# EasyEDA Pro project pcb_vc.eprj

# Schematic Sheet3
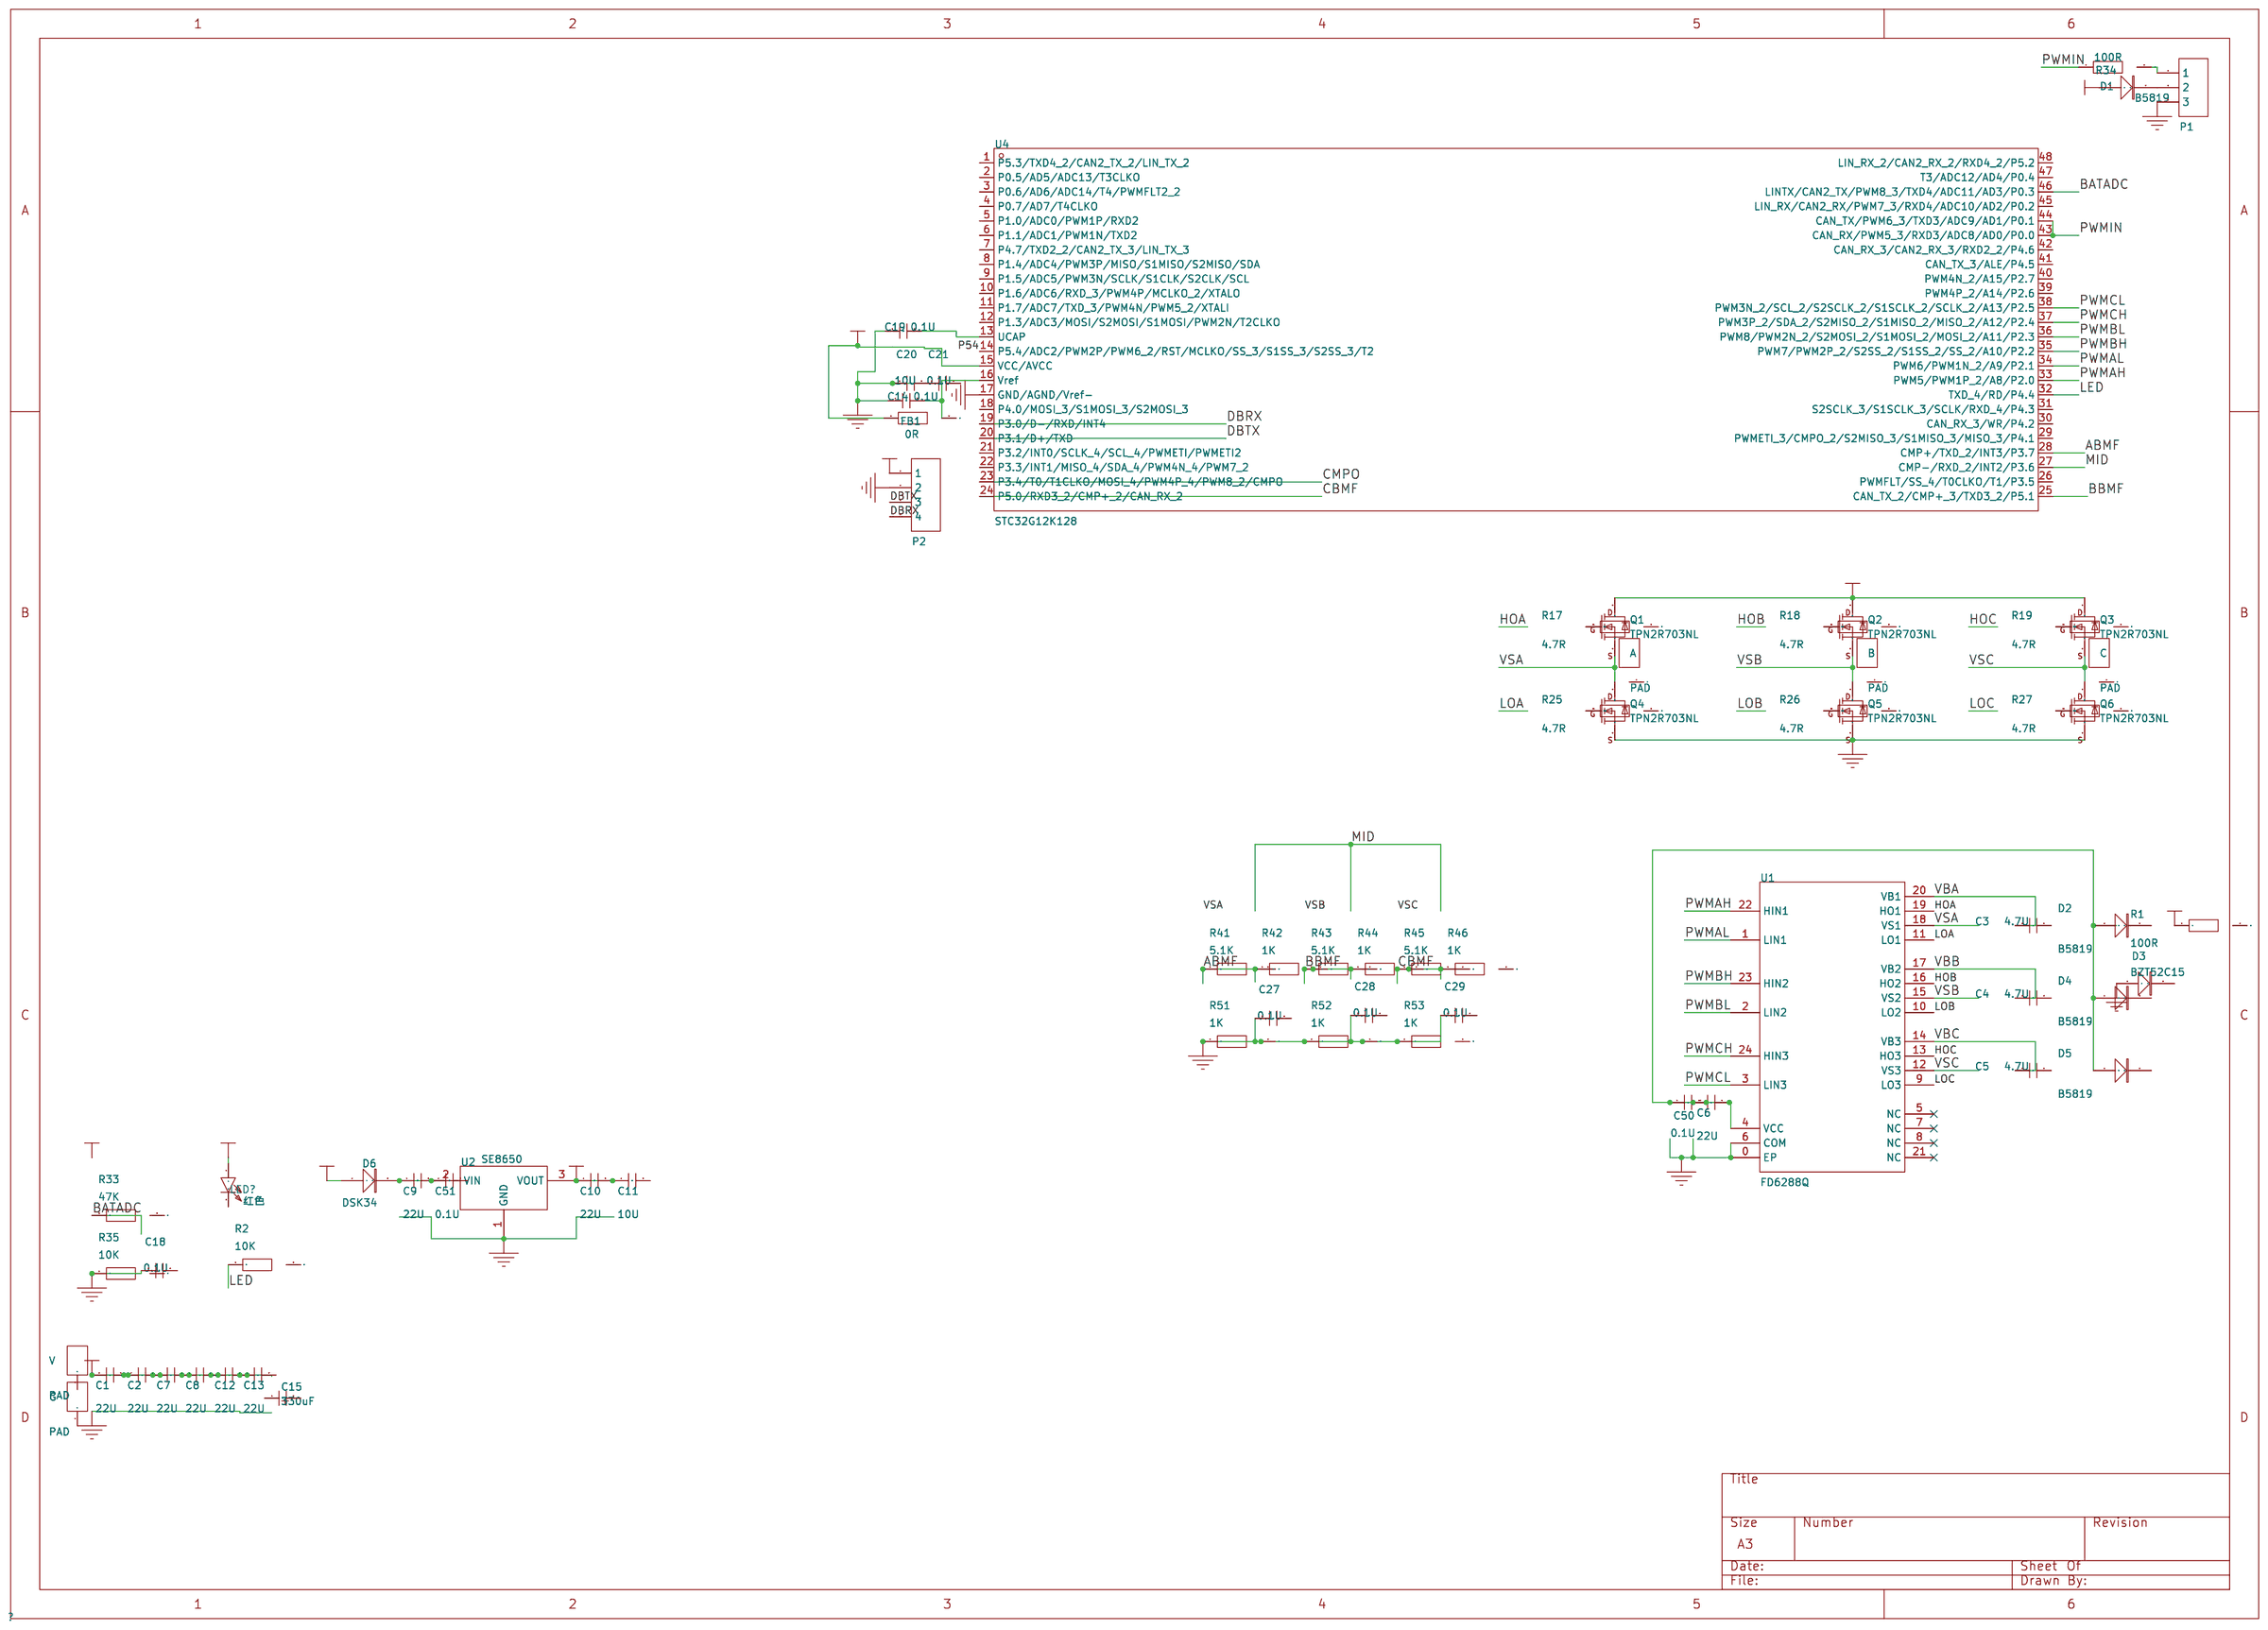
[diagram p0: schematic sheet]

## Parts
A  PAD  [PAD]
B  PAD  [PAD]
C  PAD  [PAD]
C1  22U  [C 0805_L]
C2  22U  [C 0805_L]
C3  4.7U  [C 0805_L]
C4  4.7U  [C 0805_L]
C5  4.7U  [C 0805_L]
C6  22U  [C 0805_L]
C7  22U  [C 0805_L]
C8  22U  [C 0805_L]
C9  22U  [C 0805_L]
C10  22U  [C 0805_L]
C11  10U  [C 0603_L]
C12  22U  [C 0805_L]
C13  22U  [C 0805_L]
C14  0.1U  [C 0402_L]
C15  330uF  [CAP(固态_5mm)]
C18  0.1U  [C 0603_L]
C19  0.1U  [C 0402_L]
C20  10U  [C 0603_L]
C21  0.1U  [C 0402_L]
C27  0.1U  [C 0603_L]
C28  0.1U  [C 0603_L]
C29  0.1U  [C 0603_L]
C50  0.1U  [C 0603_L]
C51  0.1U  [C 0402_L]
D1  B5819  [SOD-123]
D2  B5819  [SOD-123]
D3  BZT52C15  [SOD-123]
D4  B5819  [SOD-123]
D5  B5819  [SOD-123]
D6  DSK34  [SOD-123]
FB1  0R  [R 0603_L]
G  PAD  [PAD]
LED?#1  红色  [LED 0603B]
P1  HDR-1X3  [HDR2.54-LI-3P]
P2  HDR-1X4  [HDR2.54-LI-4P]
Q1  TPN2R703NL  [TPN2R703NL]
Q2  TPN2R703NL  [TPN2R703NL]
Q3  TPN2R703NL  [TPN2R703NL]
Q4  TPN2R703NL  [TPN2R703NL]
Q5  TPN2R703NL  [TPN2R703NL]
Q6  TPN2R703NL  [TPN2R703NL]
R1  100R  [R 0603_L]
R2  10K  [R 0603_L]
R17  4.7R  [R 0603_L]
R18  4.7R  [R 0603_L]
R19  4.7R  [R 0603_L]
R25  4.7R  [R 0603_L]
R26  4.7R  [R 0603_L]
R27  4.7R  [R 0603_L]
R33  47K  [R 0603_L]
R34  100R  [R 0603_L]
R35  10K  [R 0603_L]
R41  5.1K  [R 0603_L]
R42  1K  [R 0603_L]
R43  5.1K  [R 0603_L]
R44  1K  [R 0603_L]
R45  5.1K  [R 0603_L]
R46  1K  [R 0603_L]
R51  1K  [R 0603_L]
R52  1K  [R 0603_L]
R53  1K  [R 0603_L]
U1  FD6288Q  [FD6288Q]
U2  SE8650  [SE8650]
U4  STC32G12K128  [STC32G12K128]
V  PAD  [PAD]

## Library data of the parts
A B C G V = PAD: Library Name: 视觉原理图库
C1-C10 C12 C13 = C: 贴片电容; BOM名称: 无极性贴片电容; 淘宝ID: 封装库来自淘宝 ID：黄晶宝石; 联系售后: https://shop463601444.taobao.com; Origin Footprint 2: R 0603_L; Origin Footprint 3: C 0402_L; Origin Footprint 4: C 0603_L; Origin Footprint 5: C 1206_L; Origin Footprint 6: C 1210_L; Origin Footprint 7: C 1808_L; Origin Footprint 8: C 1812_L; Origin Footprint 9: C 1825_L; Origin Footprint 10: C 2225_L; Origin Footprint 11: C 0201_M; Origin Footprint 12: C 0402_M; Origin Footprint 13: C 0603_M; Origin Footprint 14: C 0805_M; Origin Footprint 15: C 1206_M; Origin Footprint 16: C 1210_M; Origin Footprint 17: C 1808_M; Origin Footprint 18: C 1812_M; Origin Footprint 19: C 1825_M; Origin Footprint 20: C 2225_M; Library Name: 0.1 - 电阻-电容-电感
C11 C18 C20 C27-C29 C50 = C: 贴片电容; BOM名称: 无极性贴片电容; 淘宝ID: 封装库来自淘宝 ID：黄晶宝石; 联系售后: https://shop463601444.taobao.com; Origin Footprint 2: R 0603_L; Origin Footprint 3: C 0402_L; Origin Footprint 4: C 0805_L; Origin Footprint 5: C 1206_L; Origin Footprint 6: C 1210_L; Origin Footprint 7: C 1808_L; Origin Footprint 8: C 1812_L; Origin Footprint 9: C 1825_L; Origin Footprint 10: C 2225_L; Origin Footprint 11: C 0201_M; Origin Footprint 12: C 0402_M; Origin Footprint 13: C 0603_M; Origin Footprint 14: C 0805_M; Origin Footprint 15: C 1206_M; Origin Footprint 16: C 1210_M; Origin Footprint 17: C 1808_M; Origin Footprint 18: C 1812_M; Origin Footprint 19: C 1825_M; Origin Footprint 20: C 2225_M; Library Name: 0.1 - 电阻-电容-电感
C14 C19 C21 C51 = C: 贴片电容; BOM名称: 无极性贴片电容; 淘宝ID: 封装库来自淘宝 ID：黄晶宝石; 联系售后: https://shop463601444.taobao.com; Origin Footprint 2: R 0603_L; Origin Footprint 3: C 0603_L; Origin Footprint 4: C 0805_L; Origin Footprint 5: C 1206_L; Origin Footprint 6: C 1210_L; Origin Footprint 7: C 1808_L; Origin Footprint 8: C 1812_L; Origin Footprint 9: C 1825_L; Origin Footprint 10: C 2225_L; Origin Footprint 11: C 0201_M; Origin Footprint 12: C 0402_M; Origin Footprint 13: C 0603_M; Origin Footprint 14: C 0805_M; Origin Footprint 15: C 1206_M; Origin Footprint 16: C 1210_M; Origin Footprint 17: C 1808_M; Origin Footprint 18: C 1812_M; Origin Footprint 19: C 1825_M; Origin Footprint 20: C 2225_M; Library Name: 0.1 - 电阻-电容-电感
C15 = Cap_固态电容: Library Name: NXP
D1-D6 = 1N4007: 整流二极管; BOM名称: 整流二极管; 联系售后: https://shop463601444.taobao.com; 淘宝ID: 封装库来自淘宝 ID：黄晶宝石; Origin Footprint 2: DO-41; Origin Footprint 3: SMA; Origin Footprint 4: DO-41V; Library Name: 0.2 -  二极管-整流桥
FB1 R1 R2 R17-R19 R25-R27 R33-R35 R41-R46 R51-R53 = R: 贴片电阻; BOM名称: 贴片电阻; 联系售后: https://shop463601444.taobao.com; 版权归属: 来自淘宝 ID：黄晶宝石; Origin Footprint 2: R 0201_L; Origin Footprint 3: R 0402_L; Origin Footprint 4: R 0805_L; Origin Footprint 5: R 1206_L; Origin Footprint 6: R 1210_L; Origin Footprint 7: R 1812_L; Origin Footprint 8: R 2010_L; Origin Footprint 9: R 2512_L; Origin Footprint 10: R 0201_M; Origin Footprint 11: R 0402_M; Origin Footprint 12: R 0603_M; Origin Footprint 13: R 0805_M; Origin Footprint 14: R 1206_M; Origin Footprint 15: R 1210_M; Origin Footprint 16: R 1812_M; Origin Footprint 17: R 2010_M; Origin Footprint 18: R 2512_M; Library Name: 0.1 - 电阻-电容-电感
LED?#1 = LED-SMD: 贴片LED; BOM名称: 贴片LED; 学习资源: https://shop463601444.taobao.com; 版权归属: 封装库来自淘宝 ID：黄晶宝石; Origin Footprint 2: LED 0603W; Origin Footprint 3: LED 0603R; Origin Footprint 4: LED 0603G; Origin Footprint 5: LED 0603Y; Origin Footprint 6: LED 0805G; Origin Footprint 7: LED 0805R; Origin Footprint 8: LED 0805B; Origin Footprint 9: LED 0805Y; Origin Footprint 10: LED 3528-2Pin; Origin Footprint 11: LED 1206G; Origin Footprint 12: LED 5730-V; Origin Footprint 13: LED 1206Y; Origin Footprint 14: LED 0805W; Origin Footprint 15: LED 1206B; Origin Footprint 16: LED 1206W; Origin Footprint 17: LED 1206R; Library Name: 0.3 - LED发光二极管
P1 = Header 3: 3P接插件; BOM名称: 3P接插件; 版权归属: 封装库来自淘宝 ID：黄晶宝石; 学习资源: https://shop463601444.taobao.com; Origin Footprint 2: XH2.54-WI-3P; Origin Footprint 3: XH2.54-LI-3P; Origin Footprint 4: HDR2.54-M-LI-3P; Origin Footprint 5: HDR2.54-WI-3P; Origin Footprint 6: HDR2.54-WS-3P; Origin Footprint 7: HDR2.54-Y-LI-3P; Origin Footprint 8: HDR2.54-M-WS-3P; Origin Footprint 9: KF2510-LI-3P; Origin Footprint 10: XH2.54-WS-3P; Origin Footprint 11: XH2.54-LS-3P; Origin Footprint 12: KF2EDGK-2.54-LI-3P; Origin Footprint 13: KF2EDGK-2.54-WI-3P; Library Name: 5.3 - 接插件-脚距2.54 (100mil)
P2 = Header 4: 4P接插件; BOM名称: 4P接插件; 版权归属: 封装库来自淘宝 ID：黄晶宝石; 学习资源: https://shop463601444.taobao.com; Origin Footprint 2: XH2.54-WI-4P; Origin Footprint 3: XH2.54-LI-4P; Origin Footprint 4: HDR2.54-M-LI-4P; Origin Footprint 5: HDR2.54-WI-4P; Origin Footprint 6: HDR2.54-WS-4P; Origin Footprint 7: HDR2.54-Y-LI-4P; Origin Footprint 8: HDR2.54-M-WS-4P; Origin Footprint 9: KF2510-LI-4P; Origin Footprint 10: XH2.54-WS-4P; Origin Footprint 11: XH2.54-LS-4P; Origin Footprint 12: KF2EDGK-2.54-LI-4P; Origin Footprint 13: KF2EDGK-2.54-WI-4P; Library Name: 5.3 - 接插件-脚距2.54 (100mil)
Q1-Q6 = TPN2R703NL: Library Name: 视觉原理图库
U1 = FD6288Q: Library Name: 视觉原理图库
U2 = SE8650: Library Name: 视觉原理图库
U4 = STC32G12K128: Library Name: 视觉原理图库

## Nets
GND: C1.2 C2.2 C6.2 C7.2 C8.2 C9.2 C10.2 C11.2 C12.2 C13.2 C14.1 C15.2 C18.1 C19.1 C20.1 C21.1 C27.1 C28.1 C29.1 C50.2 C51.2 D3.1(A) G.1 P1.3 P2.2 Q4.3(S) Q5.3(S) Q6.3(S) R35.1 R51.1 R52.1 R53.1 U1.0(EP) U1.6(COM) U2.1(GND) U4.17(GND/AGND/Vref-)
VBAT: C1.1 C2.1 C7.1 C8.1 C12.1 C13.1 C15.1 D6.1(A) LED?#1.1(A) Q1.1(D) Q2.1(D) Q3.1(D) R1.1 R33.2 V.1
VCC5V: C10.1 C11.1 C20.2 C21.2 D1.1(A) FB1.1 P2.1 U2.3(VOUT) U4.15(VCC/AVCC)
ABMF: C27.2 R41.1 R42.1 R51.2 U4.28(CMP+/TXD_2/INT3/P3.7)
BATADC: C18.2 R33.1 R35.2 U4.46(LINTX/CAN2_TX/PWM8_3/TXD4/ADC11/AD3/P0.3)
BBMF: C28.2 R43.1 R44.1 R52.2 U4.25(CAN_TX_2/CMP+_3/TXD3_2/P5.1)
CBMF: C29.2 R45.1 R46.1 R53.2 U4.24(P5.0/RXD3_2/CMP+_2/CAN_RX_2)
CMPO: U4.23(P3.4/T0/T1CLKO/MOSI_4/PWM4P_4/PWM8_2/CMPO)
DBRX: P2.4 U4.19(P3.0/D-/RXD/INT4)
DBTX: P2.3 U4.20(P3.1/D+/TXD)
HOA: R17.2 U1.19(HO1)
HOB: R18.2 U1.16(HO2)
HOC: R19.2 U1.13(HO3)
LED: R2.1 U4.32(TXD_4/RD/P4.4)
LOA: R25.2 U1.11(LO1)
LOB: R26.2 U1.10(LO2)
LOC: R27.2 U1.9(LO3)
MID: R42.2 R44.2 R46.2 U4.27(CMP-/RXD_2/INT2/P3.6)
P54: U4.14(P5.4/ADC2/PWM2P/PWM6_2/RST/MCLKO/SS_3/S1SS_3/S2SS_3/T2)
PWMAH: U1.22(HIN1) U4.33(PWM5/PWM1P_2/A8/P2.0)
PWMAL: U1.1(LIN1) U4.34(PWM6/PWM1N_2/A9/P2.1)
PWMBH: U1.23(HIN2) U4.35(PWM7/PWM2P_2/S2SS_2/S1SS_2/SS_2/A10/P2.2)
PWMBL: U1.2(LIN2) U4.36(PWM8/PWM2N_2/S2MOSI_2/S1MOSI_2/MOSI_2/A11/P2.3)
PWMCH: U1.24(HIN3) U4.37(PWM3P_2/SDA_2/S2MISO_2/S1MISO_2/MISO_2/A12/P2.4)
PWMCL: U1.3(LIN3) U4.38(PWM3N_2/SCL_2/S2SCLK_2/S1SCLK_2/SCLK_2/A13/P2.5)
PWMIN: R34.1 U4.43(CAN_RX/PWM5_3/RXD3/ADC8/AD0/P0.0) U4.44(CAN_TX/PWM6_3/TXD3/ADC9/AD1/P0.1)
VBA: C3.1 D2.2(K) U1.20(VB1)
VBB: C4.1 D4.2(K) U1.17(VB2)
VBC: C5.1 D5.2(K) U1.14(VB3)
VSA: A.1 C3.2 Q1.3(S) Q4.1(D) R41.2 U1.18(VS1)
VSB: B.1 C4.2 Q2.3(S) Q5.1(D) R43.2 U1.15(VS2)
VSC: C.1 C5.2 Q3.3(S) Q6.1(D) R45.2 U1.12(VS3)
Net-(LED?#1-2): LED?#1.2(K) R2.2
NETC6_1: C6.1 C50.1 D2.1(A) D3.2(K) D4.1(A) D5.1(A) R1.2 U1.4(VCC)
NETC9_1: C9.1 C51.1 D6.2(K) U2.2(VIN)
NETC14_2: C14.2 FB1.2 U4.16(Vref)
NETC19_2: C19.2 U4.13(UCAP)
NETD1_2: D1.2(K) P1.2
NETP1_1: P1.1 R34.2
NETQ1_2: Q1.2(G) R17.1
NETQ2_2: Q2.2(G) R18.1
NETQ3_2: Q3.2(G) R19.1
NETQ4_2: Q4.2(G) R25.1
NETQ5_2: Q5.2(G) R26.1
NETQ6_2: Q6.2(G) R27.1

Not connected (* = marked no-connect by the designer): U1 5(NC)* 7(NC)* 8(NC)* 21(NC)*; U4 1(P5.3/TXD4_2/CAN2_TX_2/LIN_TX_2) 2(P0.5/AD5/ADC13/T3CLKO) 3(P0.6/AD6/ADC14/T4/PWMFLT2_2) 4(P0.7/AD7/T4CLKO) 5(P1.0/ADC0/PWM1P/RXD2) 6(P1.1/ADC1/PWM1N/TXD2) 7(P4.7/TXD2_2/CAN2_TX_3/LIN_TX_3) 8(P1.4/ADC4/PWM3P/MISO/S1MISO/S2MISO/SDA) 9(P1.5/ADC5/PWM3N/SCLK/S1CLK/S2CLK/SCL) 10(P1.6/ADC6/RXD_3/PWM4P/MCLKO_2/XTALO) 11(P1.7/ADC7/TXD_3/PWM4N/PWM5_2/XTALI) 12(P1.3/ADC3/MOSI/S2MOSI/S1MOSI/PWM2N/T2CLKO) 18(P4.0/MOSI_3/S1MOSI_3/S2MOSI_3) 21(P3.2/INT0/SCLK_4/SCL_4/PWMETI/PWMETI2) 22(P3.3/INT1/MISO_4/SDA_4/PWM4N_4/PWM7_2) 26(PWMFLT/SS_4/T0CLKO/T1/P3.5) 29(PWMETI_3/CMPO_2/S2MISO_3/S1MISO_3/MISO_3/P4.1) 30(CAN_RX_3/WR/P4.2) 31(S2SCLK_3/S1SCLK_3/SCLK/RXD_4/P4.3) 39(PWM4P_2/A14/P2.6) 40(PWM4N_2/A15/P2.7) 41(CAN_TX_3/ALE/P4.5) 42(CAN_RX_3/CAN2_RX_3/RXD2_2/P4.6) 45(LIN_RX/CAN2_RX/PWM7_3/RXD4/ADC10/AD2/P0.2) 47(T3/ADC12/AD4/P0.4) 48(LIN_RX_2/CAN2_RX_2/RXD4_2/P5.2)

# Board PCB3
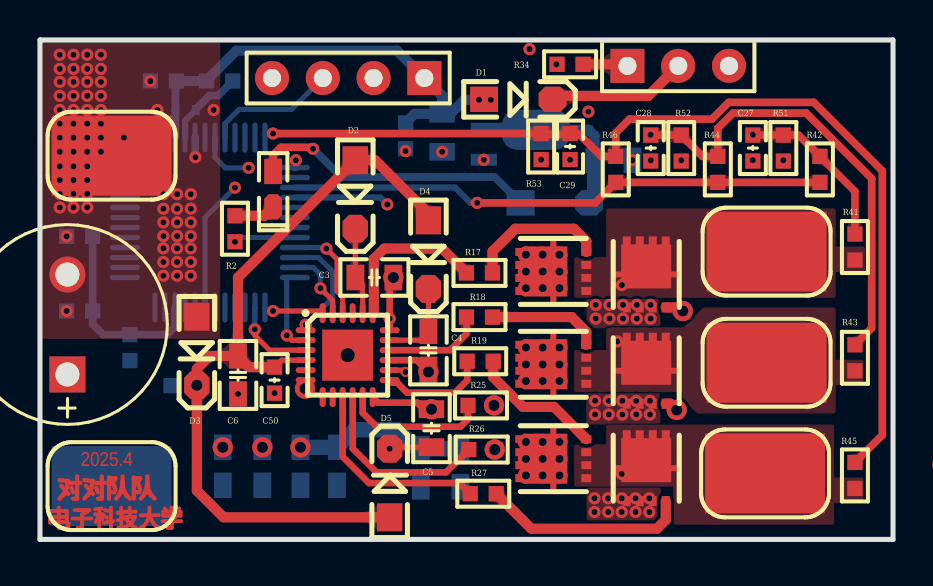
[diagram p1: board, top side]
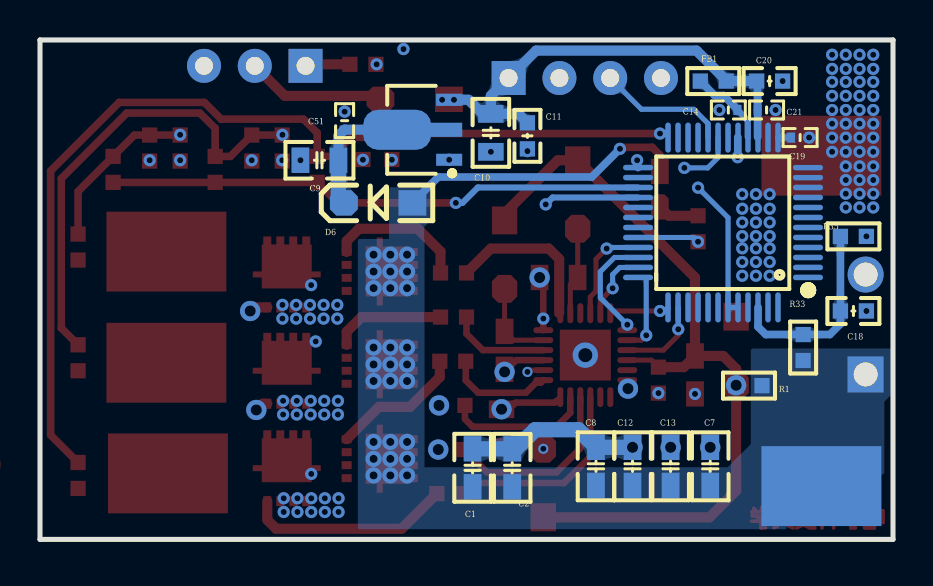
[diagram p2: board, bottom side, seen from below]

Outline 42.67 x 24.99 mm; copper layers: Top Layer, GND, S, Bottom Layer. Coordinates in mm from the lower left corner of the outline.
Outline path: 0,24.99 42.67,24.99 42.67,0 0,0 0,24.99
Stack: Top Layer 0.0356mm / Dielectric 1 0.254mm FR-4 er 4.2 / GND 0.036mm / Dielectric 3 0.127mm er 4.2 / S 0.036mm / Dielectric 2 0.254mm er 4.2 / Bottom Layer 0.0356mm

## Design rules (mm)
net R2: Sheet3
net R3: Sheet3
net JP3: Sheet3
net ?: Sheet3
net *: Sheet3
net 1: Sheet3
net 3: Sheet3
net 2: Sheet3
net *11: Sheet3
net C?: Sheet3
net JP?: Sheet3
net R?: Sheet3
net JP14: Sheet3
net R22: Sheet3
net D?: Sheet3
net A: Sheet3
net B: Sheet3
net C1: Sheet3
net C2: Sheet3
net C3: Sheet3
net C4: Sheet3
net C5: Sheet3
net C6: Sheet3
net C7: Sheet3
net C8: Sheet3
net C12: Sheet3
net C13: Sheet3
net C14: Sheet3
net C15: Sheet3
net C18: Sheet3
net C19: Sheet3
net C20: Sheet3
net C21: Sheet3
net C27: Sheet3
net C28: Sheet3
net C29: Sheet3
net C50: Sheet3
net C: Sheet3
net D1: Sheet3
net D2: Sheet3
net D3: Sheet3
net D4: Sheet3
net D5: Sheet3
net D6: Sheet3
net FB1: Sheet3
net LED?: Sheet3
net P1: Sheet3
net P2: Sheet3
net Q1: Sheet3
net Q2: Sheet3
net Q3: Sheet3
net Q4: Sheet3
net Q5: Sheet3
net Q6: Sheet3
net R1: Sheet3
net R17: Sheet3
net R18: Sheet3
net R19: Sheet3
net R25: Sheet3
net R26: Sheet3
net R27: Sheet3
net R33: Sheet3
net R34: Sheet3
net R35: Sheet3
net R41: Sheet3
net R42: Sheet3
net R43: Sheet3
net R44: Sheet3
net R45: Sheet3
net R46: Sheet3
net R51: Sheet3
net R52: Sheet3
net R53: Sheet3
net U1: Sheet3
net U4: Sheet3
net C10: Sheet3
net C11: Sheet3
net C9: Sheet3
net C51: Sheet3
net U2: Sheet3
net V: Sheet3
net G: Sheet3
template: 用户自定义配置
spacing Clearance (default): track to track 0.152, other pairs 0 to 0.152
track width Width (default): min 0.152, default 0.152, max 7.62
differential pair differentialPair (default): width min 0.127, default 0.254, max 2.54; gap min 0.152, default 0.152
via RoutingVias (default): diameter min 0.508, default 1.27, max 5.08; hole min 0.305, default 0.711, max 0.711

## Placement (name value [footprint] x y rotation side)
A  -  [PAD]  36.35 14.53 0 top
B  -  [PAD]  36.35 8.97 0 top
C  -  [PAD]  36.27 3.43 0 top
C1  22U  [C 0805_L#2]  21.03 3.58 90 bottom
C2  22U  [C 0805_L#2]  19.05 3.58 90 bottom
C3  4.7U  [C 0805_L]  16.73 13.11 0 top
C4  4.7U  [C 0805_L#2]  19.43 9.46 270 top
C5  4.7U  [C 0805_L]  19.58 5.56 90 top
C6  22U  [C 0805_L#2]  9.91 8.23 270 top
C7  22U  [C 0805_L#2]  9.14 3.66 90 bottom
C8  22U  [C 0805_L#2]  14.86 3.66 90 bottom
C9  22U  [C 0805_L]  28.69 18.97 0 bottom
C10  22U  [C 0805_L]  20.12 20.35 270 bottom
C11  10U  [C 0603_L]  18.29 20.19 270 bottom
C12  22U  [C 0805_L#2]  13.03 3.66 90 bottom
C13  22U  [C 0805_L#2]  11.13 3.66 90 bottom
C14  0.1U  [C 0402_L]  8.24 21.49 180 bottom
C15  330uF  [CAP(固态_5mm)]  1.37 8.25 90 top
C18  0.1U  [C 0603_L]  1.98 11.43 0 bottom
C19  0.1U  [C 0402_L]  4.65 20.11 0 bottom
C20  10U  [C 0603_L]  6.17 22.94 0 bottom
C21  0.1U  [C 0402_L]  6.32 21.49 0 bottom
C27  0.1U  [C 0603_L]  35.66 19.58 90 top
C28  0.1U  [C 0603_L]  30.55 19.58 90 top
C29  0.1U  [C 0603_L]  26.52 19.66 90 top
C50  0.1U  [C 0603_L]  11.74 7.97 270 top
C51  0.1U  [C 0402_L]  27.43 20.95 90 bottom
D1  B5819  [SOD-123]  23.93 22.02 0 top
D2  B5819  [SOD-123]  15.77 17.26 270 top
D3  BZT52C15  [SOD-123]  7.85 9.43 270 top
D4  B5819  [SOD-123]  19.43 14.25 270 top
D5  B5819  [SOD-123]  17.49 2.82 90 top
D6  DSK34  [SOD-123]  25.76 16.84 0 bottom
FB1  0R  [R 0603_L]  8.99 22.94 0 bottom
G  -  [PAD]  3.58 19.33 0 top
LED?  红色  [LED 0603B]  11.66 17.53 270 top
P1  HDR-1X3  [HDR2.54-LI-3P]  31.93 23.7 0 top
P2  HDR-1X4  [HDR2.54-LI-4P]  15.42 23.09 180 top
Q1  -  [TPN2R703NL]  25.68 13.41 90 top
Q2  -  [TPN2R703NL]  25.68 8.76 90 top
Q3  -  [TPN2R703NL]  25.68 4.04 90 top
Q4  -  [TPN2R703NL]  30.33 13.26 0 top
Q5  -  [TPN2R703NL]  30.33 8.44 0 top
Q6  -  [TPN2R703NL]  30.33 3.56 0 top
R1  100R  [R 0603_L]  7.2 7.7 0 bottom
R2  10K  [R 0603_L]  9.75 15.55 90 top
R17  4.7R  [R 0603_L]  21.99 13.33 180 top
R18  4.7R  [R 0603_L]  21.99 11.12 180 top
R19  4.7R  [R 0603_L]  22.02 8.92 180 top
R25  4.7R  [R 0603_L]  22.06 6.71 180 top
R26  4.7R  [R 0603_L]  22.1 4.5 180 top
R27  4.7R  [R 0603_L]  22.17 2.29 180 top
R33  47K  [R 0603_L]  4.5 9.6 270 bottom
R34  100R  [R 0603_L]  26.52 23.77 0 top
R35  10K  [R 0603_L]  1.98 15.16 0 bottom
R41  5.1K  [R 0603_L]  40.77 14.63 270 top
R42  1K  [R 0603_L]  39.01 18.52 270 top
R43  5.1K  [R 0603_L]  40.77 9.09 270 top
R44  1K  [R 0603_L]  33.91 18.52 270 top
R45  5.1K  [R 0603_L]  40.77 3.2 270 top
R46  1K  [R 0603_L]  28.8 18.52 270 top
R51  1K  [R 0603_L]  37.19 19.58 90 top
R52  1K  [R 0603_L]  32.08 19.58 90 top
R53  1K  [R 0603_L]  25.07 19.66 90 top
U1  -  [FD6288Q]  15.39 9.22 0 top
U2  -  [SE8650]  24 20.5 0 bottom
U4  -  [STC32G12K128]  8.5 15.86 90 bottom
V  -  [PAD#2]  3.58 2.79 0 top

## Footprints (pads in the part's own frame, mm; a bottom-side part is the same pattern mirrored in y, then rotated)
C 0402_L
  rect 0.4x0.5 smd: 1(-0.45,0) 2(0.45,0)
C 0603_L
  rect 0.762x0.762 smd: 1(-0.65,0) 2(0.65,0)
C 0805_L
  rect 0.889x1.27 smd: 1(-0.95,0) 2(0.95,0)
C 0805_L#2
  rect 1.27x0.889 smd: 1(-0.95,0) 2(0.95,0)
CAP(固态_5mm)
  rect 1.8x1.8 hole 1.2: 1(0,0)
  round 1.8 hole 1.2: 2(5,0)
FD6288Q
  rect 2.55x2.55 smd: 0(0,0)
  oval 1x0.3 smd: 1(-2.1,1.25) 2(-2.1,0.75) 3(-2.1,0.25) 4(-2.1,-0.25) 5(-2.1,-0.75) 6(-2.1,-1.25) 13(2.1,-1.25) 14(2.1,-0.75) 15(2.1,-0.25) 16(2.1,0.25) 17(2.1,0.75) 18(2.1,1.25)
  oval 0.3x1 smd: 7(-1.25,-2.1) 8(-0.75,-2.1) 9(-0.25,-2.1) 10(0.25,-2.1) 11(0.75,-2.1) 12(1.25,-2.1) 19(1.25,2.1) 20(0.75,2.1) 21(0.25,2.1) 22(-0.25,2.1) 23(-0.75,2.1) 24(-1.25,2.1)
HDR2.54-LI-3P
  rect 1.7x1.7 hole 0.9: 1(-2.54,0)
  round 1.7 hole 0.9: 2(0,0) 3(2.54,0)
HDR2.54-LI-4P
  rect 1.7x1.7 hole 0.9: 1(-3.81,0)
  round 1.7 hole 0.9: 2(-1.27,0) 3(1.27,0) 4(3.81,0)
LED 0603B
  rect 1.27x0.889 smd: 1(-0.889,0.006)
  custom 1.27x0.889 smd: 2(0.889,0.006)
PAD
  rect 6x4 smd: 1(0,-0.127)
PAD#2
  rect 6x4 smd far side: 1(0,-0.127)
R 0603_L
  rect 0.762x0.762 smd: 1(-0.65,0) 2(0.65,0)
SE8650
  rect 1.3x0.6 smd: 1(-1.8,1.5) 3(-1.8,-1.5)
  rect 1.7x0.7 smd: 2(-1.6,0)
SOD-123
  rect 1.397x1.27 smd: 1(-1.714,0)
  custom 1.397x1.27 smd: 2(1.714,0)
STC32G12K128
  oval 0.27x1.5 smd: 1(-2.75,-4.25) 2(-2.25,-4.25) 3(-1.75,-4.25) 4(-1.25,-4.25) 5(-0.75,-4.25) 6(-0.25,-4.25) 7(0.25,-4.25) 8(0.75,-4.25) 9(1.25,-4.25) 10(1.75,-4.25) 11(2.25,-4.25) 12(2.75,-4.25) 25(2.75,4.25) 26(2.25,4.25) 27(1.75,4.25) 28(1.25,4.25) 29(0.75,4.25) 30(0.25,4.25) 31(-0.25,4.25) 32(-0.75,4.25) 33(-1.25,4.25) 34(-1.75,4.25) 35(-2.25,4.25) 36(-2.75,4.25)
  oval 1.5x0.27 smd: 13(4.25,-2.75) 14(4.25,-2.25) 15(4.25,-1.75) 16(4.25,-1.25) 17(4.25,-0.75) 18(4.25,-0.25) 19(4.25,0.25) 20(4.25,0.75) 21(4.25,1.25) 22(4.25,1.75) 23(4.25,2.25) 24(4.25,2.75) 37(-4.25,2.75) 38(-4.25,2.25) 39(-4.25,1.75) 40(-4.25,1.25) 41(-4.25,0.75) 42(-4.25,0.25) 43(-4.25,-0.25) 44(-4.25,-0.75) 45(-4.25,-1.25) 46(-4.25,-1.75) 47(-4.25,-2.25) 48(-4.25,-2.75)
TPN2R703NL
  rect 0.4x0.5 smd: 1(-0.975,1.65) 1(-0.325,1.65) 1(0.325,1.65) 1(0.975,1.65) 2(0.975,-1.65) 3(-0.975,-1.65) 3(-0.325,-1.65) 3(0.325,-1.65)
  rect 2.5x2.2 smd: 1(0,0.4)
  rect 3.4x0.3 smd: 1(0,0)

## Nets
As in the schematic, except:
VBAT: C1.1 C2.1 C7.1 C8.1 C12.1 C13.1 C15.1 D6.1 LED?.1 Q1.1 Q2.1 Q3.1 R1.1 R33.2 V.1
NETLED?_2: LED?.2 R2.2

Pads without a net: U1 5 7 8 21; U4 1 2 3 4 5 6 7 8 9 10 11 12 18 21 22 26 29 30 31 39 40 41 42 45 47 48

## Via types
v1: diameter 1.016, hole 0.559, Top Layer to Bottom Layer, 12 vias
v2: diameter 0.61, hole 0.305, Top Layer to Bottom Layer, 139 vias
v3: diameter 1.27, hole 0.711, Top Layer to Bottom Layer, 1 via
v4: diameter 0.813, hole 0.406, Top Layer to Bottom Layer, 27 vias
v5: diameter 0.508, hole 0.305, Top Layer to Bottom Layer, 2 vias

## Routing (per net, layer and track width the routed paths; a pad name or vN(x,y) marks a point on that pad's centre or on a via; arc(x,y) is an arc through that point)
GND: length 9.8
  Bottom Layer w0.381: v2(7.77,19.13) 7.76,19.13 7.76,20.13
  Bottom Layer w0.762: v1(13.03,4.61) C8.2 15.74,5.49 17.91,5.49 18.86,4.53 C2.2 C1.2
  vias: v1(9.14,4.61) v1(11.12,4.61) v1(13.26,7.54) v2(0.99,24.25) v2(0.99,23.55) v2(0.99,22.9) v2(0.99,22.2) v2(0.99,21.49) v2(0.99,20.8) v2(0.99,20.1) v2(0.99,19.4) v2(0.99,18.67) v2(0.99,17.98) v2(0.99,17.3) v2(0.99,16.61) v2(1.33,15.16) v2(1.33,11.43) v2(1.68,24.25) v2(1.68,23.55) v2(1.68,22.9) v2(1.68,22.2) v2(1.68,21.49) v2(1.68,20.8) v2(1.68,20.1) v2(1.68,19.4) v2(1.68,18.67) v2(1.68,17.98) v2(1.68,17.3) v2(1.68,16.61) v2(2.36,24.25) v2(2.36,23.55) v2(2.36,22.9) v2(2.36,22.2) v2(2.36,21.49) v2(2.36,20.8) v2(2.36,20.1) v2(2.36,19.4) v2(2.36,18.67) v2(2.36,17.98) v2(2.36,17.3) v2(2.36,16.61) v2(3.05,24.25) v2(3.05,23.55) v2(3.05,22.9) v2(3.05,22.2) v2(3.05,21.49) v2(3.05,20.8) v2(3.05,20.1) v2(3.05,19.4) v2(4.2,20.11) v2(5.52,22.94) v2(5.87,21.49) v2(6.17,17.27) v2(6.17,16.55) v2(6.17,15.86) v2(6.17,15.18) v2(6.17,14.57) v2(6.17,13.88) v2(6.17,13.19) v2(6.86,17.27) v2(6.86,16.55) v2(6.86,15.86) v2(6.86,15.18) v2(6.86,14.57) v2(6.86,13.88) v2(6.86,13.19) v2(7.54,17.27) v2(7.54,16.55) v2(7.54,15.86) v2(7.54,15.18) v2(7.54,14.57) v2(7.54,13.88) v2(7.54,13.19) v2(8.69,21.49) v2(9.91,7.28) v2(11.73,7.32) v2(18.29,19.43) v2(20.12,19.4) v2(22.2,19) v2(24.49,24.54) v2(25.07,19) v2(26.52,19) v2(27.43,21.41) v2(27.74,2.06) v2(27.74,1.37) v2(27.8,11.73) v2(27.8,11.05) v2(27.77,6.93) v2(27.77,6.25) v2(28.42,2.06) v2(28.42,1.37) v2(28.49,11.73) v2(28.49,11.05) v2(28.45,6.93) v2(28.45,6.25) v2(29.13,6.93) v2(29.13,6.25) v2(29.1,2.06) v2(29.1,1.37) v2(29.16,11.73) v2(29.16,11.05) v2(29.64,18.97) v2(29.83,6.93) v2(29.83,6.25) v2(29.79,2.06) v2(29.79,1.37) v2(29.86,11.73) v2(29.86,11.05) v2(30.54,11.73) v2(30.54,11.05) v2(30.51,6.93) v2(30.51,6.25) v2(30.48,2.06) v2(30.48,1.37) v2(30.56,18.97) v2(32.08,18.97) v2(35.66,18.97) v2(37.19,18.97) v3(15.39,9.22)
VBAT: length 14.5
  Top Layer w0.381: v2(13.66,19.55) 13.58,19.62 12.05,19.62 11.66,19.24 11.66,18.42
  Bottom Layer w0.381: v2(13.66,19.55) 15.07,18.14 22.75,18.14 24.04,16.84
  vias: v4(24.31,14.25) v4(24.31,13.4) v4(24.31,12.57) v4(24.31,9.6) v4(24.31,8.75) v4(24.31,7.92) v4(24.31,4.88) v4(24.31,4.03) v4(24.31,3.2) v4(25.15,14.25) v4(25.15,13.4) v4(25.15,12.57) v4(25.15,9.6) v4(25.15,8.75) v4(25.15,7.92) v4(25.15,4.88) v4(25.15,4.03) v4(25.15,3.2) v4(25.98,14.25) v4(25.98,13.4) v4(25.98,12.57) v4(25.98,9.6) v4(25.98,8.75) v4(25.98,7.92) v4(25.98,4.88) v4(25.98,4.03) v4(25.98,3.2)
VCC5V: length 23
  Bottom Layer w0.381: C20.2 6.77,22.89 C21.2 6.77,20.13
  Bottom Layer w0.508: C10.1 18.74,21.3 18.29,20.85 ; C10.1 20.53,21.3 21.24,22 21.96,22 ; C10.1 20.12,22.2 P2.1 17.86,24.46 9.83,24.46 8.34,22.97 FB1.1 C20.2 ; v2(21.96,22) 22.2,22
  vias: v2(22.56,22)
ABMF: length 33.4
  Top Layer w0.381: R41.1 40.77,17.41 R42.1 37.95,20.23 R51.2 C27.2
  S w0.381: v2(35.66,20.25) 31.61,16.19 21.45,16.19 20.88,16.76 v2(17.37,16.76)
  Bottom Layer w0.305: U4.28 17.03,17.11 v2(17.37,16.76)
BATADC: length 9.9
  Bottom Layer w0.381: U4.46 6.75,10.64 6.37,10.25 R33.1 3.16,10.25 2.63,10.78 C18.2 R35.2
BBMF: length 42.3
  Top Layer w0.381: C28.2 R52.2 33.14,19.17 R44.1 33.91,20.57 34.67,21.34 38.33,21.34 41.6,18.06 41.6,10.58 R43.1
  S w0.381: v2(30.54,20.25) 13.39,20.25 12.8,19.66 v2(12.8,18.97)
  Bottom Layer w0.381: U4.25 12.8,18.66 v2(12.8,18.97)
CBMF: length 49.2
  Top Layer w0.381: R45.1 42.14,5.22 42.14,18.44 38.71,21.87 34.45,21.87 33.61,21.03 29.49,21.03 28.8,20.35 R46.1 28.08,19.17 26.97,20.27 25.45,20.27 ; v2(11.66,20.31) R53.2
  Bottom Layer w0.381: 11.45,20.31 v2(11.66,20.31)
DBRX: length 7.9
  S w0.254: v2(10.44,18.59) 10.44,20.42 11.61,21.59 P2.4
  Bottom Layer w0.254: U4.19 8.75,19.11 9.27,18.59 v2(10.44,18.59)
DBTX: length 6.5
  Bottom Layer w0.254: U4.20 9.25,20.81 9.97,21.52 12.58,21.52 P2.3
HOA: length 8.1
  Top Layer w0.508: R17.2 20.12,14.55 17.22,14.55 16.7,14.03 16.7,11.32
HOB: length 5
  Top Layer w0.33: 21.34,11.13 21.34,10.29 20.52,9.47 U1.16
HOC: length 5.4
  Top Layer w0.33: R19.2 21.37,7.96 20.76,7.34 18.36,7.34 17.86,7.84 17.62,7.84 U1.13
LED: length 3.1
  Bottom Layer w0.254: v2(9.75,14.89) 9.97,15.11 U4.32
LOA: length 7.2
  Top Layer w0.33: R25.2 21.41,6.02 21.03,5.64 16.84,5.64 16.14,6.34 U1.11
LOB: length 9.3
  Top Layer w0.33: U1.10 15.64,4.55 16.84,3.35 20.31,3.35 R26.2
LOC: length 10.1
  Top Layer w0.33: R27.2 20.99,2.82 16.46,2.82 15.14,4.14 U1.9
MID: length 27.2
  Top Layer w0.381: R42.2 R44.2 R46.2 27.78,16.84 21.72,16.84
  Bottom Layer w0.305: U4.27 20.77,17.61 21.54,16.84 v2(21.87,16.84)
NETC6_1: length 39.7
  Top Layer w0.254: U1.4 12.08,8.97 11.73,8.62
  Top Layer w0.508: C6.1 8.49,9.18 7.85,8.53 v1(7.85,7.71) 7.85,2.44 9.18,1.11 D5.1 ; C6.1 10.47,8.62 11.73,8.62 ; C6.1 9.91,13.11 D2.1 16.77,18.97 19.43,16.31 D4.1
NETC9_1: length 8.9
  Bottom Layer w0.508: U2.2 22.41,20.5 C51.1 27.74,20.19 C9.1
  Bottom Layer w0.762: C9.1 27.74,17.11 D6.2
NETC14_2: length 4
  Bottom Layer w0.305: C14.2 7.27,20.97 7.27,20.13
  Bottom Layer w0.381: FB1.2 8.92,22.21 8.48,22.21 7.79,21.52 C14.2
NETC19_2: length 0.7
  Bottom Layer w0.305: C19.2 U4.13
NETD1_2: length 7
  Top Layer w0.508: P1.2 30.43,22.2 25.82,22.2 D1.2
NETLED?_2: length 2.1
  Top Layer w0.508: 9.75,16.19 11.22,16.19 LED?.2
NETP1_1: length 2.3
  Top Layer w0.508: P1.1 29.31,23.77 R34.2
NETQ1_2: length 7
  Top Layer w0.508: Q1.2 27.33,14.93 26.71,15.55 23.77,15.55 22.64,14.41 R17.1
NETQ2_2: length 5.6
  Top Layer w0.508: 22.64,11.13 26.59,11.13 27.33,10.39 Q2.2
NETQ3_2: length 6.7
  Top Layer w0.508: Q3.2 25.71,6.63 24.16,6.63 22.67,8.12 R19.1
NETQ4_2: length 12.3
  Top Layer w0.508: v1(32.16,11.43) 31.98,11.61 Q4.2
  S w0.508: v1(22.71,6.71) 26.06,6.71 28.27,8.92 29.64,8.92 v1(32.16,11.43)
NETQ5_2: length 12.5
  Top Layer w0.508: v1(31.85,6.48) 31.54,6.79 Q5.2
  S w0.508: v1(22.75,4.5) 22.75,4.92 23.7,5.87 26.48,5.87 27.62,4.72 31.24,4.72 31.85,5.33 v1(31.85,6.48)
NETQ6_2: length 10.3
  Top Layer w0.508: Q6.2 31.3,0.97 30.86,0.53 24.58,0.53 R27.1
PWMAH: length 5.2
  Top Layer w0.254: v2(14.33,14.55) 14.86,14.02 14.86,12.42 15.14,12.14 U1.22
  Bottom Layer w0.254: U4.33 14.27,14.61 v2(14.33,14.55)
PWMAL: length 5.7
  Top Layer w0.254: U1.1 v2(13.29,10.74)
  Bottom Layer w0.254: U4.34 13.93,14.11 14.64,13.4 14.64,12.09 v2(13.29,10.74)
PWMBH: length 3.6
  Top Layer w0.254: U1.23 14.64,11.95 v2(14.03,12.57)
  Bottom Layer w0.254: v2(14.03,12.57) 14.03,13.25 13.67,13.61 U4.35
PWMBL: length 4.4
  Top Layer w0.254: U1.2 12.59,9.97 v2(12.34,10.21)
  Bottom Layer w0.254: v2(12.34,10.21) 12.34,13.11 U4.36
PWMCH: length 3
  Top Layer w0.254: v2(11.66,11.43) 14.03,11.43 U1.24
  Bottom Layer w0.254: v2(11.66,11.43) 11.43,11.43 U4.37
PWMCL: length 4.3
  Top Layer w0.254: v2(10.74,10.52) 10.74,10.21 11.49,9.47 U1.3
  Bottom Layer w0.254: v2(10.74,10.52) 10.74,11.6 U4.38
PWMIN: length 26.4
  S w0.254: v2(9.75,17.6) 11.01,17.6 11.74,18.32 11.74,19.43 13.34,21.03 19.89,21.03 22.63,23.77 v2(25.83,23.77)
  Bottom Layer w0.254: v2(9.75,17.6) 8.25,16.1 U4.43 U4.44
VBA: length 4.4
  Top Layer w0.254: D2.2 15.77,13.11 C3.1 16.14,12.74 U1.20
VBB: length 4.2
  Top Layer w0.254: D4.2 C4.1 18.99,9.97 U1.17
VBC: length 7.1
  Top Layer w0.254: v5(18.29,8.38) 18.2,8.47 U1.14 ; v5(17.49,4.53) 17.57,4.61 C5.1
  S w0.254: v5(17.49,4.53) 18.29,5.33 v5(18.29,8.38)
VSA: length 15.1
  Top Layer w0.254: 17.49,12.92 v1(17.68,13.11)
  Top Layer w0.33: U1.18 v2(17.49,11.05) 17.49,12.92
  S w0.33: v1(17.68,13.11) 21.87,13.11 23.24,11.73 26.59,11.73 27.58,12.73 v2(29.11,12.73)
VSB: length 12.6
  Top Layer w0.33: U1.15 18.84,8.97 v1(19.43,8.38)
  S w0.33: v2(28.88,9.91) 28.42,10.36 21.41,10.36 v1(19.43,8.38)
VSC: length 14.9
  Top Layer w0.254: 19.21,6.51 v1(19.58,6.51) ; U1.12 16.83,6.93
  Top Layer w0.33: 16.83,6.93 16.92,6.84 18.88,6.84 19.21,6.51
  S w0.33: v2(29.1,3.28) 27.81,3.28 26.97,2.44 23.39,2.44 19.58,6.25 v1(19.58,6.51)

## Copper pours and planes (outline as drawn; the poured copper is in the pictures)
GND on Top Layer: 30.94,12.12 30.92,12.1 27.43,12.1 27.43,10.67 30.94,10.67
GND on Top Layer: 0.08,24.77 0.08,10.13 8.92,10.13 8.92,24.77
GND on Top Layer: 30.96,2.5 30.94,2.49 27.45,2.49 27.45,1.05 30.96,1.05
GND on Top Layer: 30.94,7.3 30.92,7.29 27.43,7.29 27.43,5.86 30.94,5.86
GND on GND: -0.76,25.02 -0.76,0.56 -0.53,0.33 41.91,0.33 41.91,25.09
VBAT on Bottom Layer: 5.41,4.72 7.01,4.72 8.22,3.5 23.55,3.5 23.55,14.94 26.67,14.94 26.67,0.61 5.41,0.61
VBAT on Bottom Layer: 23.55,14.94 23.55,15.7 23.24,16 23.24,17.53 25.11,17.53 25.11,14.94
VBAT on Bottom Layer: 0.53,3.35 0.53,6.93 -0.08,7.54 -0.08,9.45 7.01,9.45 7.01,3.35
VSA on Top Layer: 26.82,14.02 28.42,14.02 28.42,16.46 39.7,16.46 39.7,12.19 26.82,12.19
VSA on Top Layer: 39.55,14.55 41.22,14.55 41.22,13.49 39.55,13.49
VSB on Top Layer: 39.57,8.89 41.1,8.89 41.1,7.82 39.57,7.82
VSB on Top Layer: 26.82,9.37 28.42,9.37 28.42,10.52 32.23,10.52 32.23,7.47 26.82,7.47
VSB on Top Layer: 32.23,10.52 33.22,11.51 39.7,11.51 39.7,6.4 32.92,6.4 32.23,7.09
VSC on Top Layer: 39.5,3 41.1,3 41.1,1.93 39.5,1.93
VSC on Top Layer: 31.78,2.74 31.78,0.84 39.62,0.84 39.62,2.74
VSC on Top Layer: 26.82,4.65 28.42,4.65 28.42,5.64 39.62,5.64 39.62,2.74 26.82,2.74

Small or netless copper shapes (teardrops, artwork), in the pictures only: 91 on Top Layer, 58 on Bottom Layer, 20 on S

## Text on the board
Top Layer: 2025.4 | A上 | B | C | A下 | 电子科技大学 | 对对队队
Top Solder Mask Layer: 2025.4 | 电子科技大学 | 对对队队
